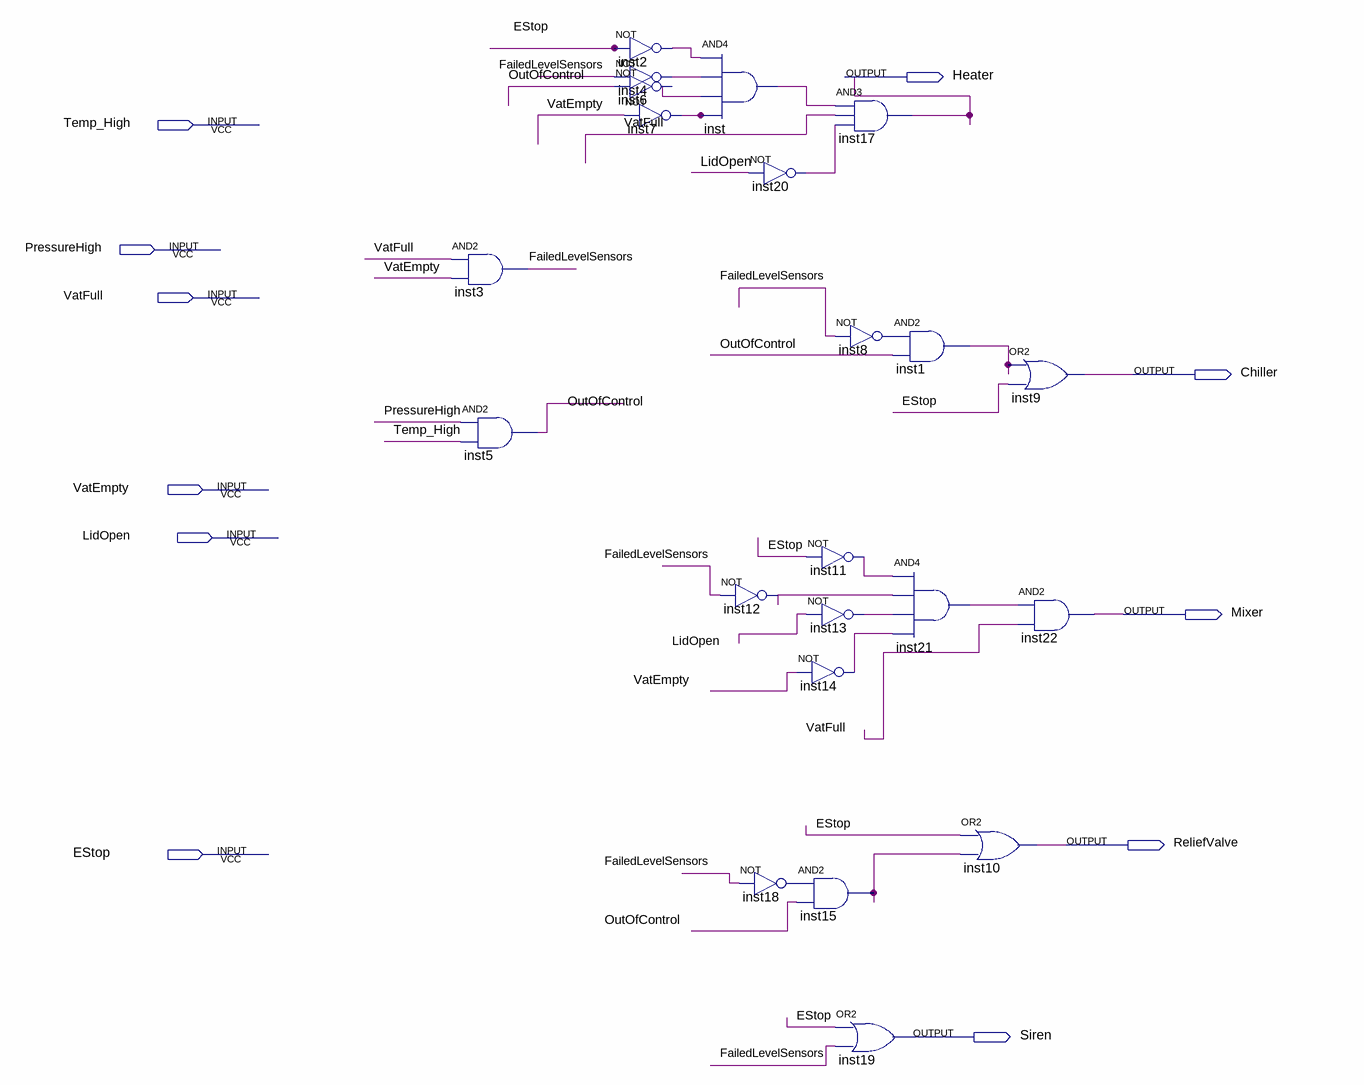
[diagram p0: schematic sheet]
// Quartus schematic Lab1.bdf as structural Verilog: 22 symbols, 11 pins
module Lab1 (
  input  Temp_High,
  input  PressureHigh,
  input  VatFull,
  input  VatEmpty,
  input  LidOpen,
  input  EStop,
  output Heater,
  output Chiller,
  output Mixer,
  output ReliefValve,
  output Siren
);

  wire FailedLevelSensors, inst1_out, inst2_out, inst4_out, inst6_out, inst7_out, inst8_out, inst11_out,
       inst12_out, inst13_out, inst14_out, inst15_out, inst18_out, inst20_out, inst21_out, inst_out,
       OutOfControl;

  and inst3 (FailedLevelSensors, VatFull, VatEmpty);
  and inst5 (OutOfControl, PressureHigh, Temp_High);
  not inst2 (inst2_out, EStop);
  not inst4 (inst4_out, FailedLevelSensors);
  not inst6 (inst6_out, OutOfControl);
  not inst7 (inst7_out, VatEmpty);
  and inst (inst_out, inst2_out, inst4_out, inst6_out, inst7_out);
  not inst12 (inst12_out, FailedLevelSensors);
  not inst18 (inst18_out, FailedLevelSensors);
  not inst20 (inst20_out, LidOpen);
  not inst11 (inst11_out, EStop);
  not inst13 (inst13_out, LidOpen);
  not inst14 (inst14_out, VatEmpty);
  and inst15 (inst15_out, inst18_out, OutOfControl);
  and inst17 (Heater, inst_out, VatFull, inst20_out);
  and inst1 (inst1_out, inst8_out, OutOfControl);
  not inst8 (inst8_out, FailedLevelSensors);
  and inst21 (inst21_out, inst11_out, inst12_out, inst13_out, inst14_out);
  or inst19 (Siren, EStop, FailedLevelSensors);
  or inst10 (ReliefValve, EStop, inst15_out);
  or inst9 (Chiller, inst1_out, EStop);
  and inst22 (Mixer, inst21_out, VatFull);
endmodule
